# EAGLE design out8_16A_bo_1_0 (EAGLE 5.04)
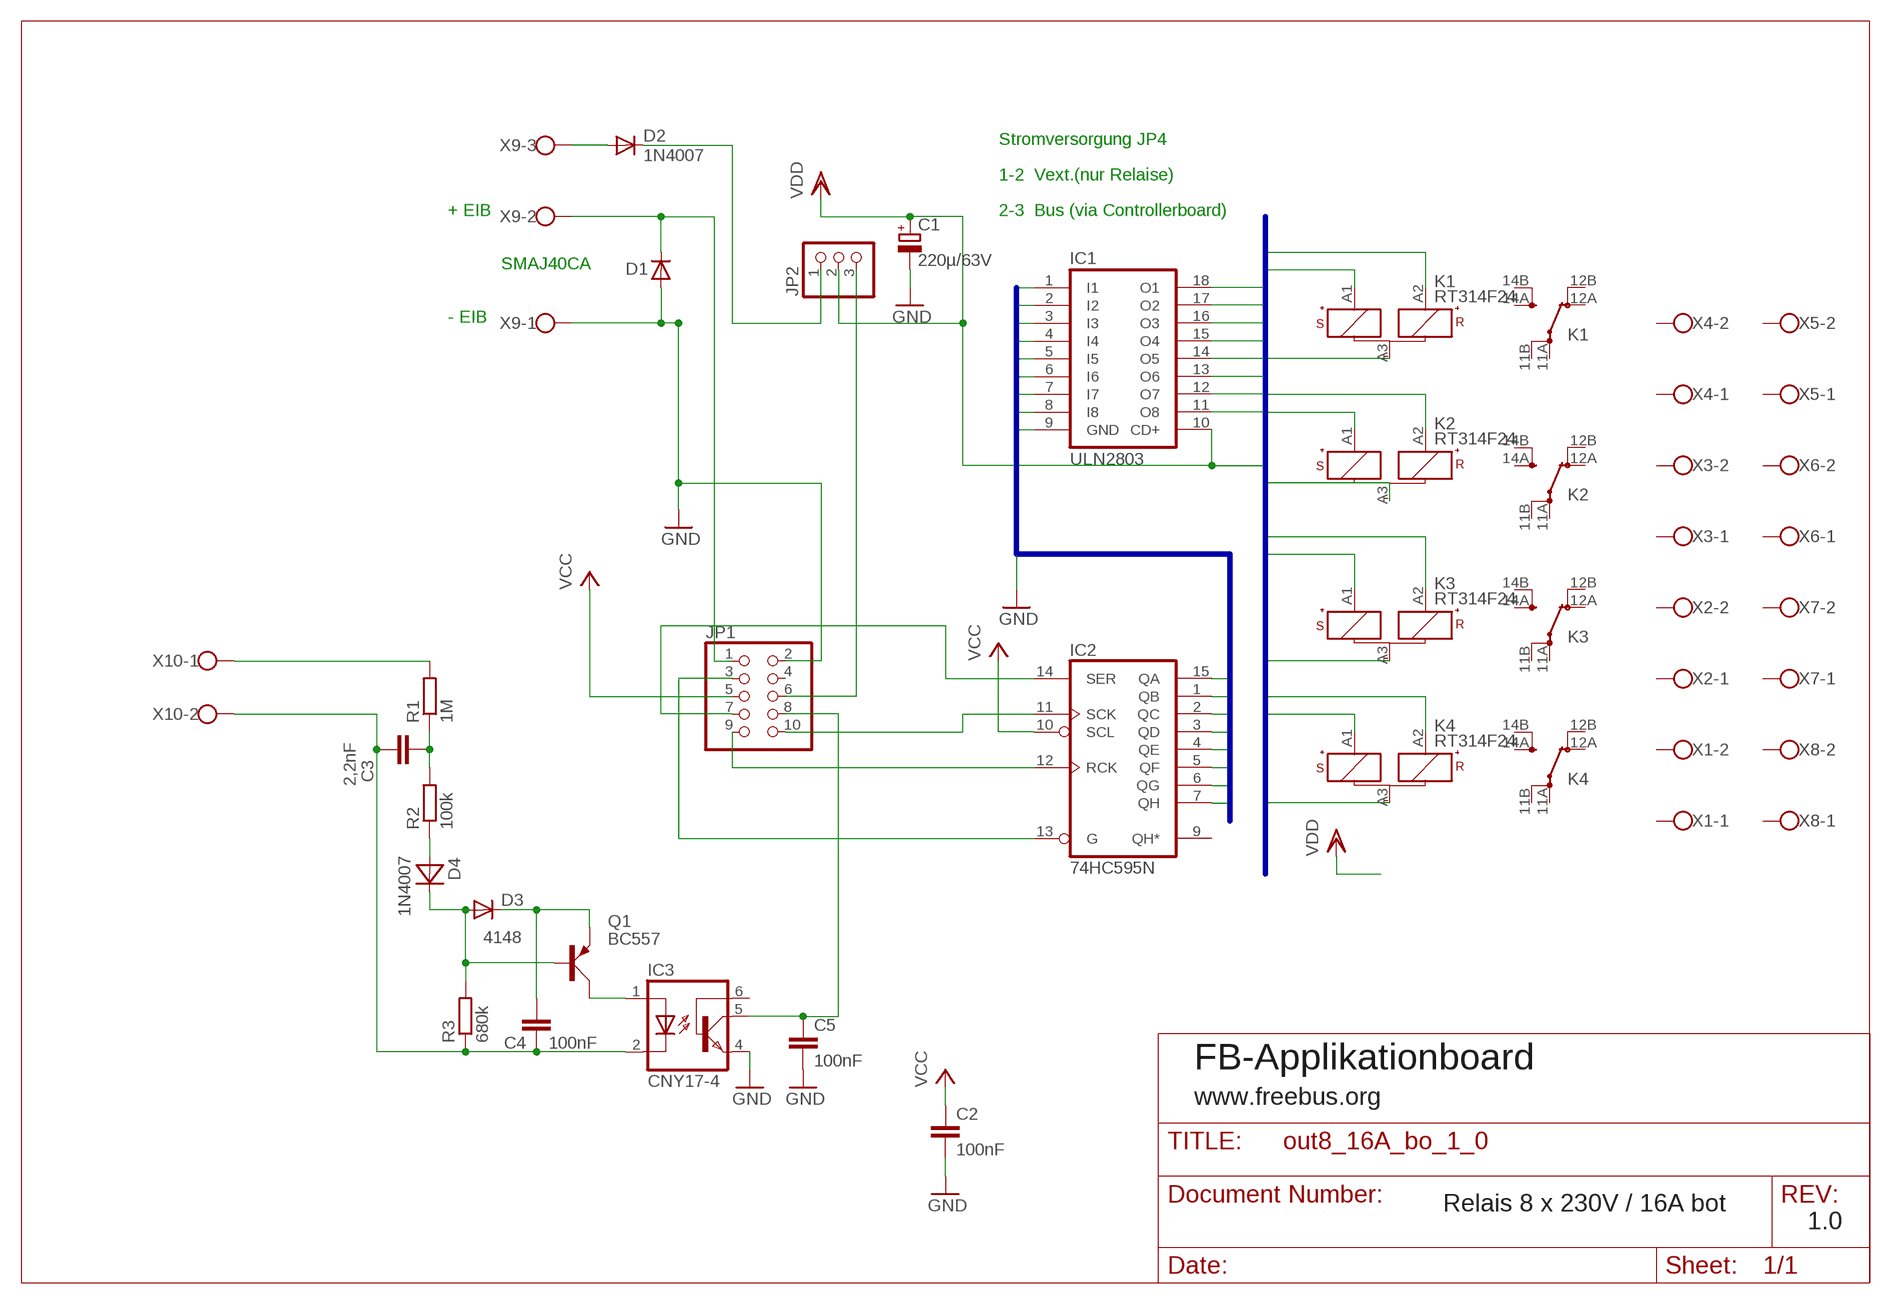
[diagram p0: schematic, sheet 1]

## Parts
C1  220µ/63V  CPOL-EUE5-10.5  [E5-10,5]
C2  100nF  C-EU050-024X044  [C050-024X044]
C3  2,2nF  C-EU102-043X133  [C102-043X133]
C4  100nF  C-EU050-024X044  [C050-024X044]
C5  100nF  C-EU050-024X044  [C050-024X044]
D1  D-SMB  [SMB]
D2  1N4007  1N4004  [DO41-10]
D3  4148  1N41481448V  [D-2.5]
D4  1N4007  [DO41-7]
IC1  ULN2803  ULN2803A  [DIL18]
IC2  74HC595N  [DIL16]
IC3  CNY17-4  CNY17  [DIL06]
JP1  PINHD-2X5  [2X05]
JP2  PINHD-1X3  [1X03]
K1  RT314F24  [RT1-BI]
K2  RT314F24  [RT1-BI]
K3  RT314F24  [RT1-BI]
K4  RT314F24  [RT1-BI]
Q1  BC557  [SOT54A]
R1  1M  R-EU_0207/7  [0207/7]
R2  100k  R-EU_0207/7  [0207/7]
R3  680k  R-EU_0207/7  [0207/7]
X1  W237-102  [W237-102]
X2  W237-102  [W237-102]
X3  W237-102  [W237-102]
X4  W237-102  [W237-102]
X5  W237-102  [W237-102]
X6  W237-102  [W237-102]
X7  W237-102  [W237-102]
X8  W237-102  [W237-102]
X9  W237-103  [W237-103]
X10  W237-102  [W237-102]

## Nets
GND: C1.- C2.2 C5.2 D1.2(A) IC1.9(GND) IC3.4(EMI) JP1.2 X9.1
N$10: IC2.14(SER) JP1.7
N$11: IC2.11(SCK) JP1.10
N$15: IC2.13(G) JP1.3
N$17: D2.A X9.3
N$20: D1.1(C) JP1.1 X9.2
N$24: IC2.12(RCK) JP1.9
N$25: D2.C JP2.1
N$27: R1.2 X10.1
N$28: IC3.1(A) Q1.C
N$38: C4.2 D3.C Q1.E
N$39: D4.A R2.1
N$40: C3.2 C4.1 IC3.2(C) R3.1 X10.2
N$42: D3.A D4.C Q1.B R3.2
N$45: C3.1 R1.1 R2.2
O1: IC1.11(O8) K2.A2(1:R+)
O2: IC1.12(O7) K2.A1(1:S+)
O3: IC1.13(O6) K1.A2(1:R+)
O4: IC1.14(O5) K1.A1(1:S+)
O5: IC1.15(O4) K4.A2(1:R+)
O6: IC1.16(O3) K4.A1(1:S+)
O7: IC1.17(O2) K3.A2(1:R+)
O8: IC1.18(O1) K3.A1(1:S+)
SERPARA1: IC1.8(I8) IC2.15(QA)
SERPARA2: IC1.7(I7) IC2.1(QB)
SERPARA3: IC1.6(I6) IC2.2(QC)
SERPARA4: IC1.5(I5) IC2.3(QD)
SERPARA5: IC1.4(I4) IC2.4(QE)
SERPARA6: IC1.3(I3) IC2.5(QF)
SERPARA7: IC1.2(I2) IC2.6(QG)
SERPARA8: IC1.1(I1) IC2.7(QH)
VCC: C2.1 IC2.10(SCL) JP1.5
VDD: C1.+ IC1.10(CD+) JP2.2 K1.A3(1:-) K2.A3(1:-) K3.A3(1:-) K4.A3(1:-)
VERS: JP1.6 JP2.3
ZERODETECT: C5.1 IC3.5(COL) JP1.8
Unconnected: IC2.9(QH*) IC3.6(BAS) JP1.4 K1.11A(2:PA) K1.11B(2:PB) K1.12A(2:OA) K1.12B(2:OB) K1.14A(2:SA) K1.14B(2:SB) K2.11A(2:PA) K2.11B(2:PB) K2.12A(2:OA) K2.12B(2:OB) K2.14A(2:SA) K2.14B(2:SB) K3.11A(2:PA) K3.11B(2:PB) K3.12A(2:OA) K3.12B(2:OB) K3.14A(2:SA) K3.14B(2:SB) K4.11A(2:PA) K4.11B(2:PB) K4.12A(2:OA) K4.12B(2:OB) K4.14A(2:SA) K4.14B(2:SB) X1.1 X1.2 X2.1 X2.2 X3.1 X3.2 X4.1 X4.2 X5.1 X5.2 X6.1 X6.2 X7.1 X7.2 X8.1 X8.2

## Buses
SERPARA[1..8],GND
O[1..8],VDD

## Notes on the sheet
- Stromversorgung JP4
- 1-2  Vext.(nur Relaise)
- + EIB | 2-3  Bus (via Controllerboard)
- SMAJ40CA
- - EIB
- FB-Applikationboard
- www.freebus.org
- Relais 8 x 230V / 16A bot
- 1.0

## Power pins joined to a net without a drawn wire
GND: IC2.8(GND)
VCC: IC2.16(VCC)

## Library data of the parts
C1 = rcl:CPOL-EU: POLARIZED CAPACITOR, European symbol
C2-C5 = rcl:C-EU: CAPACITOR, European symbol
D1 = semicon-smd-ipc:D-: DIODE unfilled
D2 = diode:1N4004: DIODE general purpose rectifier, 1 A
D3 = diode:1N4148: DIODE high speed (Philips)
D4 = diode:1N4007
IC1 = uln-udn:ULN2803A: DRIVER ARRAY
IC2 = 74xx-eu:74*595: 8-bit SHIFT REGISTER, output latch
IC3 = optocoupler:CNY17: SIEMENS OPTO COUPLER
JP1 = pinhead:PINHD-2X5: PIN HEADER
JP2 = pinhead:PINHD-1X3: PIN HEADER
K1-K4 = relay:RT?F*: Power PCB Relay SCHRACK bistable 1 pole 16 A, polarized bistable version Source: http://www.schrack.com/.. 5821.pdf
Q1 = transistor-small-signal:BC557: PNP TRANSISTOR
R1-R3 = rcl:R-EU_: RESISTOR, European symbol
X1-X8 X10 = con-wago-500:W237-102: WAGO SCREW CLAMP
X9 = con-wago-500:W237-103: WAGO SCREW CLAMP

## Net classes
1 230Vac: width 1.93 mm, clearance 5.08 mm to class 0, clearance 1.905 mm

## Board
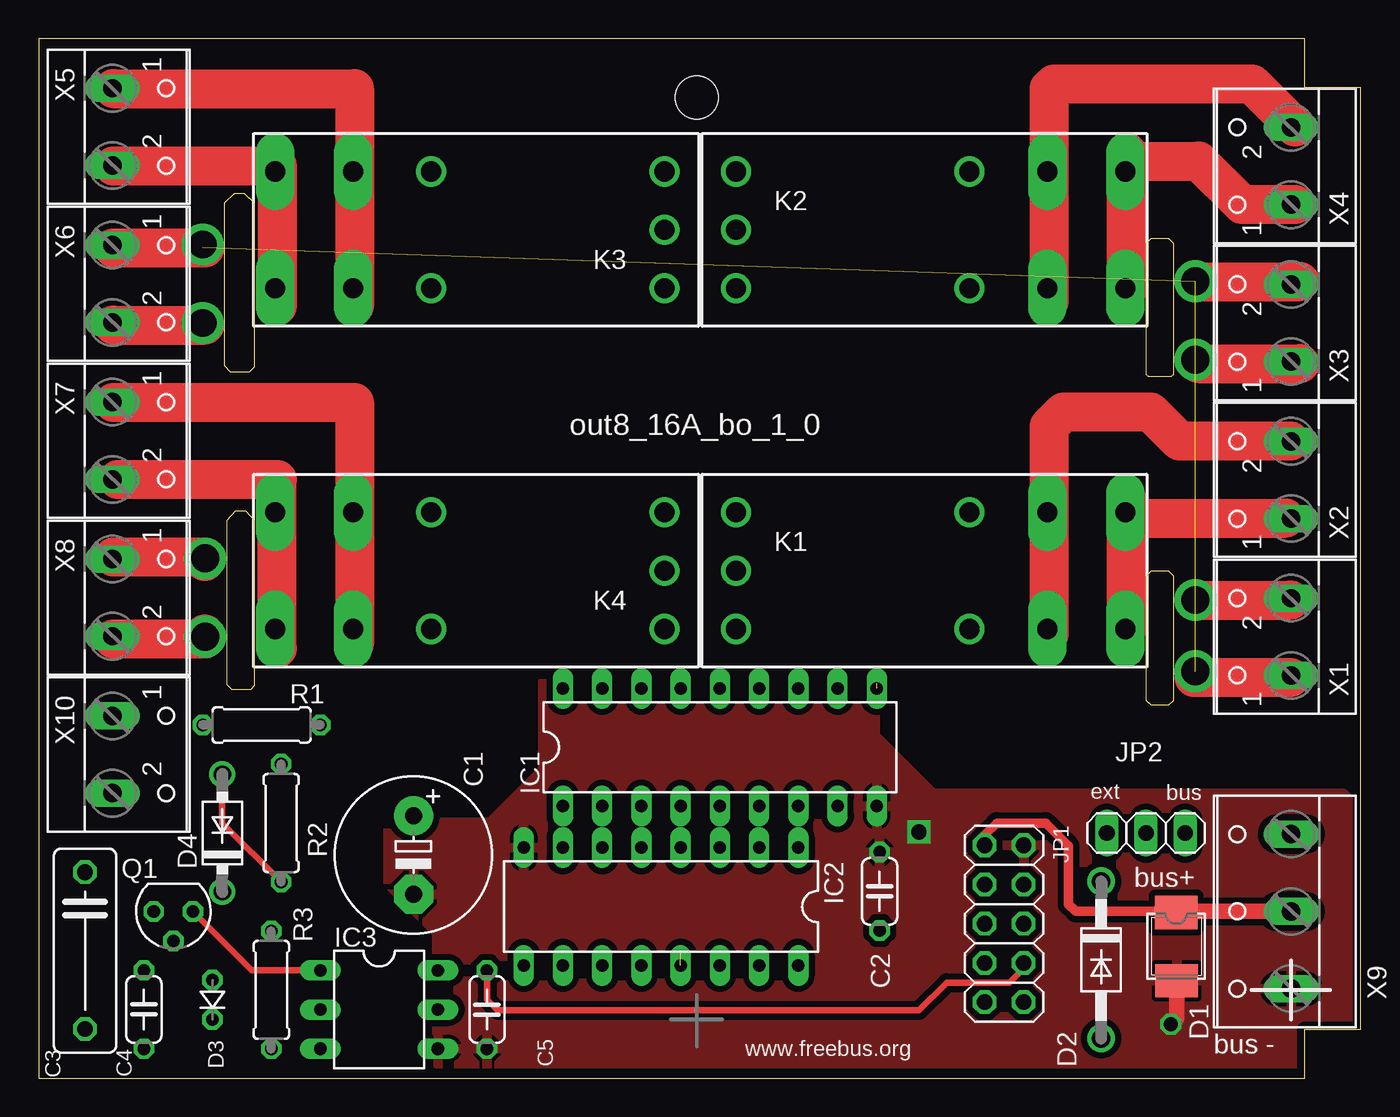
[diagram p1: board, top side]
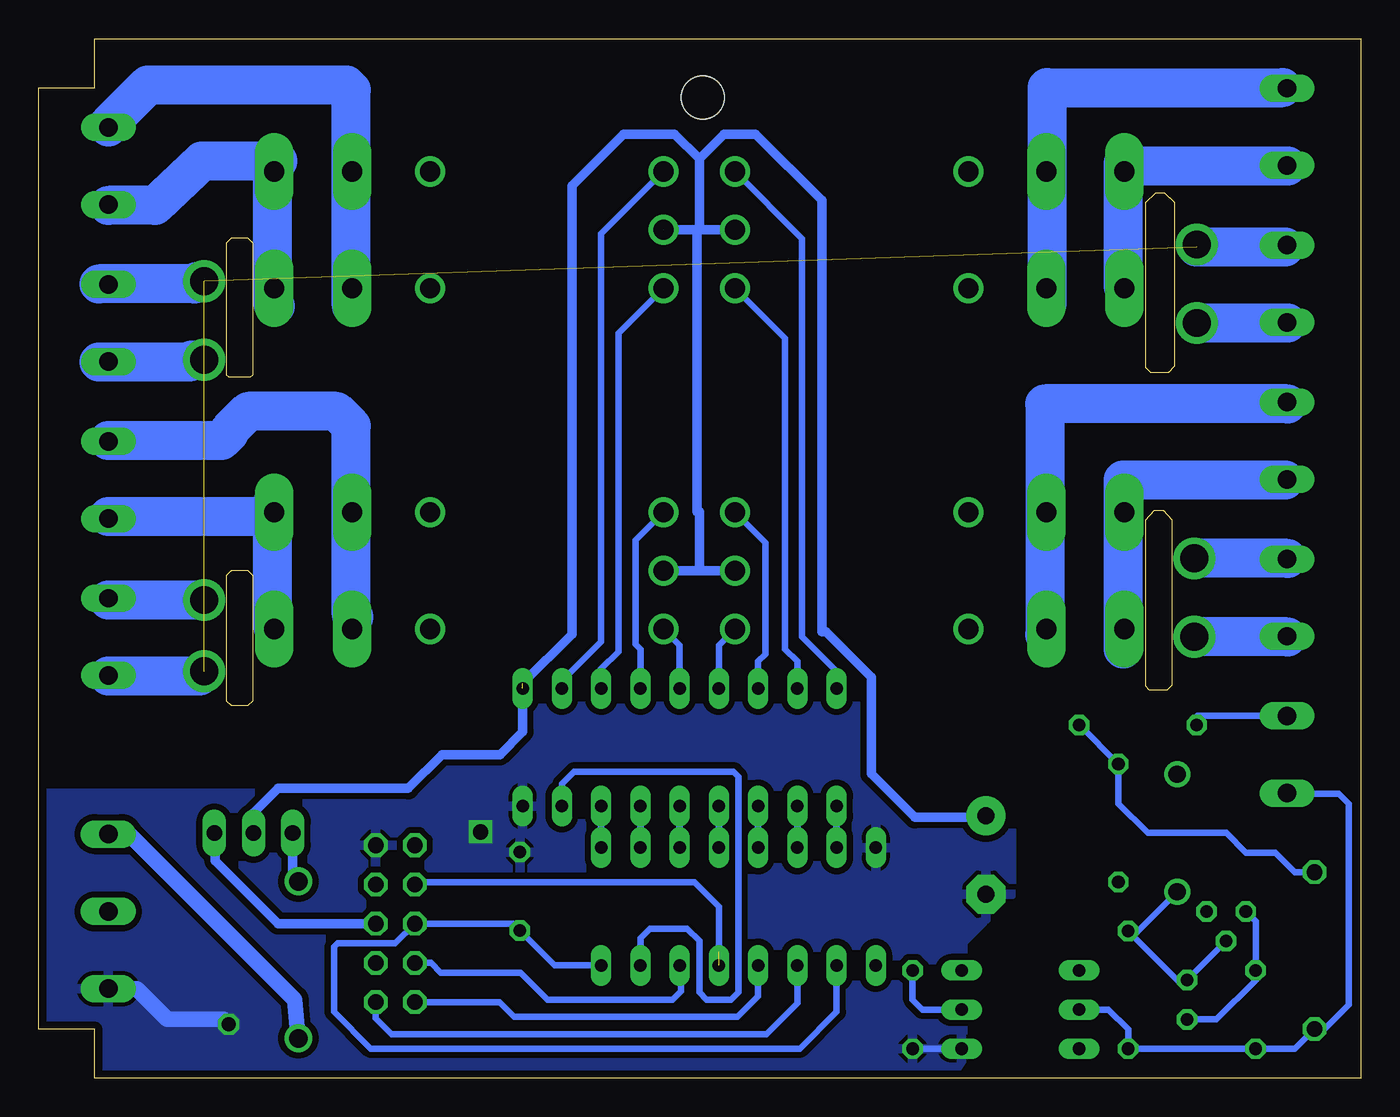
[diagram p2: board, bottom side, seen from below]

Size 85.65 x 67.31 mm. Coordinates in mm from the lower left corner, seen from the top.
Outline: 0,0.01 82,0 82,3.18 85.65,3.18 85.65,64.13 82,64.13 82,67.31 0,67.31 0,0.01
Outline: 12.06,56.67 12.69,57.31 13.33,57.31 13.96,56.67 13.96,46.04 13.65,45.72 12.46,45.72 12.06,46.12 12.06,56.67
Outline: 12.22,36.12 12.77,36.75 13.41,36.75 13.96,36.12 13.96,25.4 13.73,25.16 12.54,25.16 12.22,25.48 12.22,36.12
Outline: 71.75,54.05 72.07,54.37 73.18,54.37 73.49,54.05 73.49,45.56 73.34,45.4 71.91,45.4 71.75,45.56 71.75,54.05
Outline: 71.75,32.54 72.07,32.86 73.18,32.86 73.49,32.54 73.49,24.45 73.18,24.13 72.07,24.13 71.75,24.45 71.75,32.54
Copper layers (1*16): Top 0.035mm / dielectric 1.5mm / Bottom 0.035mm
Design rules "default": minimum track width 10mil, minimum drill 24mil, track to track 16mil, track to pad 12mil, pad to pad 16mil, via to via 16mil, smd to smd 8mil, copper to edge 20mil, drill to drill 10mil, minimum pad ring 10mil, minimum via ring 8mil, stop-mask expansion 4mil, vias tented up to drill 0mil, thermal gap 10mil
Holes 2.8 mm at 42.63,63.5
tKeepout: area 40.5,61.4 to 44.6,65.6; area 22.8,21.5 to 25.8,24.5
bRestrict: area 52.8,41.9 to 57.8,46.9

### Footprints (pad centres in the part's own frame; a part is rotated, then mirrored left to right if it is on the bottom)
E5-10,5 = drill 1.1 pad 2.54 round: + -2.54,0 | drill 1.1 pad 2.54 octagon: - 2.54,0
C050-024X044 = drill 0.813 octagon: 1 -2.54,0; 2 2.54,0
C102-043X133 = drill 1.016 octagon: 1 -5.08,0; 2 5.08,0
SMB = smd 2.159 x 2.743: 1 -2.311,-0.127; 2 2.108,-0.102
DO41-10 = drill 1.2 round: A 5.08,0; C -5.08,0
D-2.5 = drill 0.813 octagon: A 1.27,0; C -1.27,0
DO41-7 = drill 1.118 round: A 3.81,0; C -3.81,0
DIL18 = drill 0.813 long: 1 -10.16,-3.81; 2 -7.62,-3.81; 3 -5.08,-3.81; 4 -2.54,-3.81; 5 0,-3.81; 6 2.54,-3.81; 7 5.08,-3.81; 8 7.62,-3.81; 9 10.16,-3.81; 10 10.16,3.81; 11 7.62,3.81; 12 5.08,3.81; 13 2.54,3.81; 14 0,3.81; 15 -2.54,3.81; 16 -5.08,3.81; 17 -7.62,3.81; 18 -10.16,3.81
DIL16 = drill 0.813 long: 1 -8.89,-3.81; 2 -6.35,-3.81; 3 -3.81,-3.81; 4 -1.27,-3.81; 5 1.27,-3.81; 6 3.81,-3.81; 7 6.35,-3.81; 8 8.89,-3.81; 9 8.89,3.81; 10 6.35,3.81; 11 3.81,3.81; 12 1.27,3.81; 13 -1.27,3.81; 14 -3.81,3.81; 15 -6.35,3.81; 16 -8.89,3.81
DIL06 = drill 0.813 long: 1 -2.54,-3.81; 2 0,-3.81; 3 2.54,-3.81; 4 2.54,3.81; 5 0,3.81; 6 -2.54,3.81
2X05 = drill 1.016 octagon: 1 -5.08,-1.27; 2 -5.08,1.27; 3 -2.54,-1.27; 4 -2.54,1.27; 5 0,-1.27; 6 0,1.27; 7 2.54,-1.27; 8 2.54,1.27; 9 5.08,-1.27; 10 5.08,1.27
1X03 = drill 1.016 long: 1 -2.54,0; 2 0,0; 3 2.54,0
RT1-BI = drill 1.3 pad 2.5 long: 11A 7.56,3.78; 11B 7.56,-3.78; 14A 12.6,3.78; 14B 12.6,-3.78 | drill 1.3 round: 12A 2.52,3.78; 12B 2.52,-3.78; A1 -12.6,-3.78; A2 -12.6,3.78; A3 -12.6,0
SOT54A = drill 0.813 octagon: B 0,1.905; C -1.27,0; E 1.27,0
0207/7 = drill 0.813 octagon: 1 -3.81,0; 2 3.81,0
W237-102 = drill 1.194 long: 1 -2.5,-1.27; 2 2.5,-1.27
W237-103 = drill 1.194 long: 1 -5,-1.29; 2 0,-1.29; 3 5,-1.29

### Placement (x,y rotation side)
C1  24.28,14.45 270 top
C2  54.48,12.1 90 top
C3  3.01,8.26 270 top
C4  6.82,4.45 90 top
C5  29.05,4.45 270 top
D1  73.81,8.41 270 top
D2  68.83,7.66 270 top
D3  11.27,5.08 90 top
D4  11.9,15.88 90 top
IC1  44.13,21.43 0 top
IC2  40.32,11.11 180 top
IC3  22.06,4.45 270 top
JP1  62.54,10 270 top
JP2  71.73,15.87 0 top
K1  57.78,32.86 0 top
K2  57.78,54.93 0 top
K3  27.93,54.93 180 top
K4  27.93,32.86 180 top
Q1  8.73,10.79 180 top
R1  14.44,22.87 180 top
R2  15.71,16.52 90 top
R3  15.08,5.71 90 top
X1  79.84,28.58 90 top
X2  79.84,38.73 90 top
X3  79.84,48.89 90 top
X4  79.84,59.05 90 top
X5  6.06,61.59 270 top
X6  6.06,51.43 270 top
X7  6.06,41.27 270 top
X8  6.06,31.12 270 top
X9  79.84,10.79 90 top
X10  6.06,20.96 270 top

### Tracks (layer width: path | path; a pad name or v marks a point on that pad's centre or on a via)
GND  (via drill 0.9, 1)
  Top 0.406: D1.2 73.34,6.25
  Top 0.61: 73.34,6.25 72.64,6.25
  Top 1.016: D1.2 73.71,3.87 v73.34,3.49
  Bottom 0.406: IC3.4 C5.2
  Bottom 1.016: X9.1 79.29,5.79 77.3,3.81 73.65,3.81 v73.34,3.49
  other vias: 57.02,15.95
  pour Bottom: 25.77,1.26 25.77,8.76 22.65,11.88 22.65,18.14 23.27,18.76 30.77,18.76 31.71,19.7 31.71,25.95 32.34,26.57 53.59,26.57 59.84,20.32 61.71,18.45 85.15,18.45 85.46,18.14 85.46,0.32 26.4,0.32
  pour Top: 25.77,0.95 25.77,9.38 22.65,12.51 22.65,16.26 22.96,16.57 29.21,16.57 32.65,20.01 32.65,25.64 33.59,26.57 53.27,26.57 54.21,25.64 54.21,22.2 57.96,18.45 84.52,18.45 85.15,17.82 85.15,2.51 83.58,0.95
N$3  (via drill 1.8 pad 2.54)  (4 unrouted)
  Bottom 2.54: 4.92,53.82 10.63,53.82 v10.63,53.98 | 81.11,26.04 75.24,26.04 v74.92,26.35
  other vias: 74.92,51.59 74.92,46.51 74.92,30.96
N$4  (via drill 1.8 pad 2.54)
  Bottom 2.54: 4.76,48.89 v10.63,48.89
N$5  (via drill 1.8 pad 2.54)
  Bottom 2.54: 4.76,33.66 v10.79,33.66 | v10.79,33.66
N$6  (via drill 1.8 pad 2.54)
  Bottom 2.54: 4.76,28.58 v10.79,28.58
N$10
  Bottom 0.406: JP1.7 60.24,7.46 59.6,6.83 54.45,6.83 52.7,5.08 44.6,5.08 44.05,5.64 44.05,7.22 IC2.14
N$11
  Bottom 0.406: JP1.10 63.81,3.89 62.78,2.86 38.49,2.86 36.51,4.84 IC2.11
N$12
  Bottom 2.54: 5.07,64.14 20.31,64.14 20.31,50.16
N$13
  Bottom 2.54: 15.39,51.28 15.39,59.21
N$14
  Bottom 2.54: 4.76,59.05 15.23,59.05 15.23,58.9
N$15  (1 unrouted)
  Bottom 0.406: JP1.3 61.11,12.7 54.76,12.7 43.17,12.7 41.59,11.11 IC2.13 | 41.59,8.18
N$16
  Bottom 2.54: 4.76,43.66 20.47,43.66 20.47,28.73
N$17
  Bottom 1.016: X9.3 79.77,15.79 69.05,5.08 D2.A
N$19
  Bottom 2.54: 4.92,38.73 15.39,38.73 15.39,27.78
N$20
  Top 0.406: 73.33,10.75 D1.1 73.18,10.85
  Top 0.61: JP1.1 61.27,15.72 62.06,16.51 65.24,16.51 66.71,15.04 66.71,11.26 67.17,10.79 73.12,10.79 73.18,10.85
  Top 1.016: X9.2 73.75,10.79 D1.1
N$24
  Bottom 0.406: JP1.9 55.79,4.92 54.84,3.97 40.4,3.97 39.05,5.32 IC2.12
N$25
  Bottom 0.61: D2.C 69.19,13.1 JP2.1
N$27
  Bottom 0.406: X10.1 10.59,23.46 R1.2
N$28
  Top 0.406: IC3.1 13.81,6.98 Q1.C
N$29
  Bottom 2.54: 81.11,61.59 81.11,61.75 78.57,64.29 65.72,64.29 65.4,63.98 65.4,50.01
N$30
  Bottom 2.54: 70.48,58.74 70.48,50.16 70.32,50.01
N$31
  Bottom 2.54: 81.11,56.52 78.1,56.52 75.08,59.37 70.16,59.37
N$32
  Bottom 2.54: 74.92,51.59 75.4,51.59 75.56,51.43 81.75,51.43
N$33
  Bottom 2.54: 74.92,46.51 75.72,46.51 75.88,46.35 81.75,46.35
N$34
  Bottom 2.54: 70.48,29.21 70.48,36.35 | 70.48,36.35 70.48,37.31 | 70.48,36.35 81.11,36.35
N$36
  Bottom 2.54: 81.11,41.27 73.81,41.27 73.34,41.75 73.34,41.91 72.07,43.18 66.35,43.18 65.4,42.23 65.4,30 65.24,29.85
N$37
  Bottom 2.54: 74.92,30.96 81.11,30.96
N$38
  Bottom 0.406: D3.C 9.36,3.81 6.82,6.35 C4.2 6.82,10.16 Q1.E
N$39
  Top 0.406: D4.A 11.9,16.52 R2.1
N$40
  Bottom 0.406: IC3.2 16.35,4.45 15.08,3.17 R3.1 C4.1 4.28,1.91 C3.2 2.38,3.17 0.78,4.77 0.78,17.78 1.42,18.42 4.75,18.42 X10.2
N$41
  Top 2.54: 4.83,64.07 20.46,64.07 20.46,50.01
N$42
  Bottom 0.406: D4.C 14.44,9.53 R3.2 11.9,6.35 D3.A Q1.B
N$43
  Top 2.54: 4.83,59.07 15.46,59.07 15.46,50.01
N$44
  Top 2.54: 4.83,53.76 10.77,53.76
N$45
  Bottom 0.406: C3.1 4.28,13.33 5.55,14.61 7.46,14.61 8.73,15.88 13.81,15.88 15.71,17.78 R2.2 R1.1
N$46
  Top 2.54: 4.83,48.76 10.77,48.76
N$47
  Top 2.54: 4.83,43.76 20.46,43.76 20.46,28.14
N$48
  Top 2.54: 5.15,38.76 15.46,38.76 15.46,27.82
N$49
  Top 2.54: 4.83,33.76 10.77,33.76 10.77,33.45
N$50
  Top 2.54: 4.83,28.45 10.77,28.45 10.77,28.76
N$51
  Top 2.54: 81.4,61.57 78.58,64.39 65.77,64.39 65.46,64.07 65.46,50.32
N$52
  Top 2.54: 70.46,50.95 70.46,60.01
N$53
  Top 2.54: 81.4,56.57 77.96,56.57 75.15,59.38 70.77,59.38
N$54
  Top 2.54: 75.15,51.57 81.71,51.57
N$55
  Top 2.54: 75.15,46.26 81.71,46.26
N$56
  Top 2.54: 81.08,41.26 73.9,41.26 72.02,43.13 66.4,43.13 65.46,42.2 65.46,28.76
N$57
  Top 2.54: 70.46,29.07 70.46,37.51
N$58
  Top 2.54: 70.77,36.26 80.77,36.26
N$59
  Top 2.54: 74.83,30.95 81.08,30.95
N$60
  Top 2.54: 74.83,25.95 81.08,25.95
O1
  Bottom 0.406: IC1.11 51.75,25.72 49.21,28.26 49.21,54.68 K2.A2
O2
  Bottom 0.406: IC1.12 49.21,26.51 48.09,27.62 48.09,48.23 K2.A1
O3
  Bottom 0.406: IC1.13 46.67,27.78 46.98,28.1 46.98,34.84 K1.A2
O4
  Bottom 0.406: IC1.14 44.13,28.03 K1.A1
O5
  Bottom 0.406: IC1.15 41.59,28.03 K4.A2
O6
  Bottom 0.406: IC1.16 39.05,26.99 38.57,27.46 38.57,34.68 K4.A1
O7
  Bottom 0.406: IC1.17 36.51,26.99 37.3,27.78 37.3,47.91 K3.A2
O8
  Bottom 0.406: IC1.18 33.97,26.35 36.19,28.58 36.19,54.36 K3.A1
SERPARA1
  Bottom 0.406: IC1.8 51.75,19.05 50.95,19.84 40.63,19.84 40.32,19.53 40.32,5.56 40.79,5.08 42.38,5.08 42.86,5.56 42.86,8.89 43.65,9.68 46.03,9.68 46.67,9.05 IC2.15 | IC2.15
SERPARA2
  Bottom 0.406: IC1.7 | IC2.1 IC1.7
SERPARA3
  Bottom 0.406: IC1.6 | IC2.2 IC1.6
SERPARA4
  Bottom 0.406: IC1.5 | IC2.3 IC1.5
SERPARA5
  Bottom 0.406: IC1.4 | IC2.4 IC1.4
SERPARA6
  Bottom 0.406: IC1.3 | IC2.5 IC1.3
SERPARA7
  Bottom 0.406: IC1.2 | IC2.6 IC1.2
SERPARA8
  Bottom 0.406: IC1.1 | IC2.7 IC1.1
VCC
  Bottom 0.406: 49.13,7.3 IC2.16 52.22,7.3 C2.1 54.92,10 JP1.5 62.54,8.73 66.27,8.73 66.51,8.49 66.51,4.29 64.13,1.91 36.35,1.91 33.97,4.29 IC2.10
VDD  (2 unrouted)
  Bottom 0.61: 42.86,32.86 K1.A3 | 42.86,32.86 K4.A3 | 42.86,32.86 | 54.29,25.56 51.11,28.73 51.11,57.78 47.78,61.12 44.44,61.12 42.86,59.53 | 42.86,32.86 42.86,36.67 43.02,36.67 43.02,54.93 | K3.A3 42.86,54.93 42.86,55.09 | 43.02,54.93 K2.A3 | 42.86,55.09 43.02,54.93 | 42.86,59.53 42.86,55.09 | 42.86,59.53 41.27,61.12 39.2,61.12 34.92,56.83 34.92,28.89 | 34.92,28.89 | 34.92,28.89 34.66,28.89 31.71,25.95 31.71,19.7 28.9,16.89 24.38,16.89 C1.+ | JP2.2 71.71,15.89 71.71,17.2 70.15,18.76 61.71,18.76 59.52,20.95 55.77,20.95 54.29,22.43 IC1.10
VERS
  Bottom 0.61: JP2.3 74.21,15.81 74.21,14.07 70.14,10 JP1.6
ZERODETECT
  Top 0.406: JP1.8 63.81,7.11 62.88,6.18 58.82,6.18 57.02,4.38 29.74,4.38 29.05,5.08 C5.1
  Bottom 0.406: IC3.5 28.41,4.45 29.05,5.08 C5.1

### Text on the board
tPlace: out8_16A_bo_1_0 | ext | bus | bus+ | bus -
tNames: www.freebus.org
Document: A5 | A4 | A6 | A3 | A7 | A2 | A8 | A1 | Vext+ | EIB + | EIB -